# Altium schematic sheet CON1.SchDoc
size A4; SheetNumber: 1; SheetTotal: 6
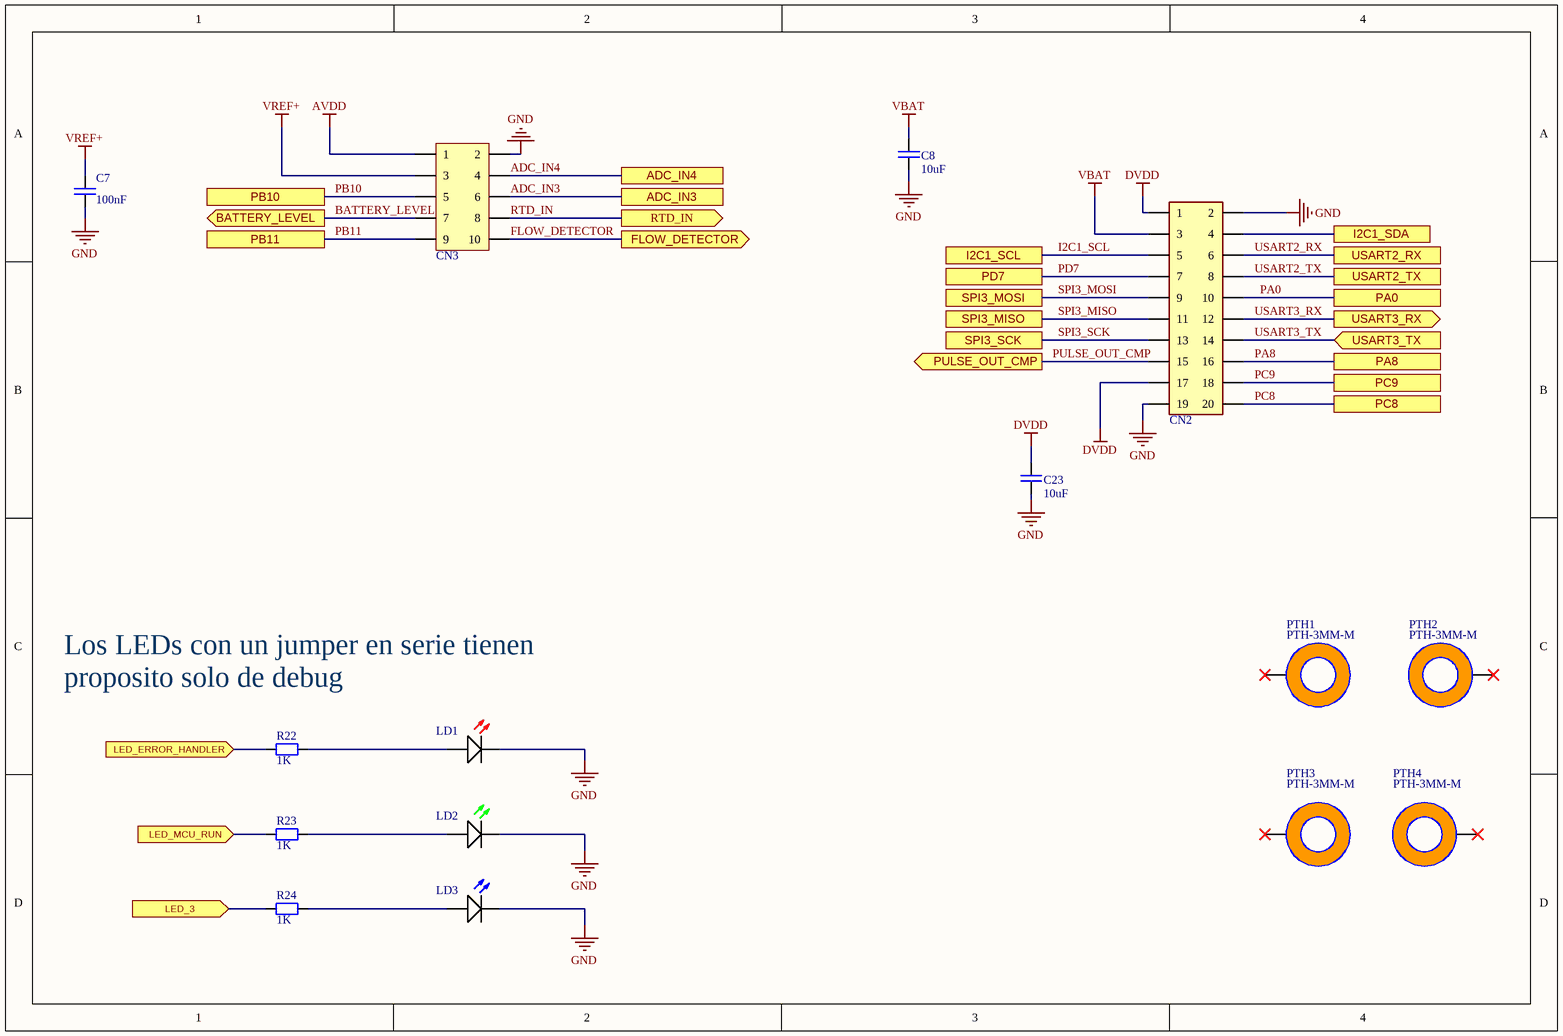
[diagram p0: CON1.SchDoc]

## Parts
C7  100nF  [CAP_SM0805_YAGEOCC2_N]
C8  10uF  [CAP_SM0805_YAGEOCC2_N]
C23  10uF  [CAP_SM0805_YAGEOCC2_N]
CN2  DW254R-22-20-85  [DW254R-22-10-85]  (value not drawn)
CN3  DW254S-22-10-85  [2X5 100 MILS SMD]  (value not drawn)
LD1  RED  [LED 0805]  (value not drawn)
LD2  GREEN  [LED 0805]  (value not drawn)
LD3  BLUE  [LED 0805]  (value not drawn)
PTH1  PTH-3MM-M  [PTH_M3_M]
PTH2  PTH-3MM-M  [PTH_M3_M]
PTH3  PTH-3MM-M  [PTH_M3_M]
PTH4  PTH-3MM-M  [PTH_M3_M]
R22  1K  [RES_SM0805_YAGEORC_N]
R23  1K  [RES_SM0805_YAGEORC_N]
R24  1K  [RES_SM0805_YAGEORC_N]

## Ports
ADC_IN3, ADC_IN4, BATTERY_LEVEL (out), FLOW_DETECTOR (out), I2C1_SCL, I2C1_SDA, LED_3 (in), LED_ERROR_HANDLER (in), LED_MCU_RUN (in), PA0, PA8, PB10, PB11, PC8, PC9, PD7, PULSE_OUT_CMP (out), RTD_IN (out), SPI3_MISO, SPI3_MOSI, SPI3_SCK, USART2_RX, USART2_TX, USART3_RX (out), USART3_TX (in)

## Nets
AVDD: CN3.1
DVDD: C23.2 CN2.1 CN2.17
GND: C7.2 C8.2 C23.1 CN2.2 CN2.19 CN3.2 LD1.K LD2.K LD3.K
VBAT: C8.1 CN2.3
VREF+: C7.1 CN3.3
ADC_IN3: CN3.6 ; port ADC_IN3
ADC_IN4: CN3.4 ; port ADC_IN4
BATTERY_LEVEL: CN3.7 ; port BATTERY_LEVEL
FLOW_DETECTOR: CN3.10 ; port FLOW_DETECTOR
I2C1_SCL: CN2.5 ; port I2C1_SCL
I2C1_SDA: CN2.4 ; port I2C1_SDA
LED_3: R24.1 ; port LED_3
LED_ERROR_HANDLER: R22.1 ; port LED_ERROR_HANDLER
LED_MCU_RUN: R23.1 ; port LED_MCU_RUN
PA0: CN2.10 ; port PA0
PA8: CN2.16 ; port PA8
PB10: CN3.5 ; port PB10
PB11: CN3.9 ; port PB11
PC8: CN2.20 ; port PC8
PC9: CN2.18 ; port PC9
PD7: CN2.7 ; port PD7
PULSE_OUT_CMP: CN2.15 ; port PULSE_OUT_CMP
RTD_IN: CN3.8 ; port RTD_IN
SPI3_MISO: CN2.11 ; port SPI3_MISO
SPI3_MOSI: CN2.9 ; port SPI3_MOSI
SPI3_SCK: CN2.13 ; port SPI3_SCK
USART2_RX: CN2.6 ; port USART2_RX
USART2_TX: CN2.8 ; port USART2_TX
USART3_RX: CN2.12 ; port USART3_RX
USART3_TX: CN2.14 ; port USART3_TX
NetLD1_A: LD1.A R22.2
NetLD2_A: LD2.A R23.2
NetLD3_A: LD3.A R24.2

Not connected (* = marked no-connect by the designer): PTH1 1*; PTH2 1*; PTH3 1*; PTH4 1*

## Notes on the sheet
- Los LEDs con un jumper en serie tienen proposito solo de debug
- Title:
- Size: A4
- Date:
- Sheet:
- Time:
- Of:
- Version:
- Revision:
- Release:
- FLOWMEET SRL
- File

## Library data of the parts
C7 = CC0805KRX7R9BB104: CAP 100nF SM0805 X7R 50V YAGEO CC2; Tolerance (%): 10; Voltage Rating (Volts): 50; Category: Capacitor; Manufacturer: Yageo; Manufacturer Part Number: CC0805KRX7R9BB104; Package: 0805; Value: 100nF; Supplier Part Number 1: 3019949; Supplier 1: Farnell; ComponentLink1URL: http://www.yageo.com; ComponentLink1Description: Manufacturer Website; Supplier 2: Digi-Key; Supplier Part Number 2: 311-1140-1-ND
C8 C23 = CC0805KKX5R8BB106: CAP 10uF SM0805 X5R 25V YAGEO; Tolerance: 10; Category: Capacitor; Manufacturer: Yageo; Manufacturer Part Number: CC0805KKX5R8BB106; Package: 0805; Value: 10uF; ComponentLink1Description: Manufacturer Website; ComponentLink1URL: http://www.yageo.com
CN2 = DW254R-22-20-85: 2 x 10 - true hole 2.54mm - altura 8.5mm; Manufacturer: Dealon; Category: Header female; Manufacturer Part Number: DW254R-22-20-85
CN3 = DW254S-22-10-85: 2 x 5 - SMD 2.54mm - altura 8.5mm; Manufacturer: Dealon; Category: Header female; Manufacturer Part Number: DW254S-22-10-85; Datasheet: https://datasheet.lcsc.com/lcsc/2209141730_DEALON-DW254S-22-10-85_C5160820.pdf
LD1 = 17-21SYGC/S530-E2/TR8: Manufacturer: Everlight Elec; ComponentLink1Description: Datasheet; ComponentLink1URL: https://datasheet.lcsc.com/lcsc/1808272351_Everlight-Elec-17-21SURC-S530-A2-TR8_C131244.pdf; Manufacturer Part Number: 17-21SYGC/S530-E2/TR8; Category: LED
LD2 = 17-21SURC/S530-A2/TR8: Manufacturer: Everlight Elec; Manufacturer Part Number: 17-21SYGC/S530-E2/TR8; ComponentLink1Description: Datasheet; Category: LED; Datasheet: https://datasheet.lcsc.com/lcsc/1811011222_Everlight-Elec-17-21SYGC-S530-E2-TR8_C73548.pdf
LD3 = 17-21/BHC-XL2M2TY/3T: Manufacturer: Everlight Elec; Manufacturer Part Number: 17-21/BHC-XL2M2TY/3T; Category: LED; Datasheet: https://datasheet.lcsc.com/lcsc/1809192317_Everlight-Elec-17-21-BHC-XL2M2TY-3T_C72035.pdf
PTH1-PTH4 = PTH-3MM-M: Agujero de montaje metalizado roscas M3. Drill de tamaño medio.
R22-R24 = RC0805FR-071KL: RES 1K SM0805 YAGEO RC_L; Power (Watts): 0.125; Resistance (Ohms): 1000; Tolerance (%): 1; Category: Resistor; Manufacturer: Yageo; Manufacturer Part Number: RC0805FR-071KL; Package: 0805; Value: 1K; Supplier Part Number 1: 9237496; Supplier 1: Farnell; ComponentLink1URL: http://www.yageo.com; ComponentLink1Description: Manufacturer Website; Supplier 2: Digi-Key; Supplier Part Number 2: 311-1.00KCRCT-ND